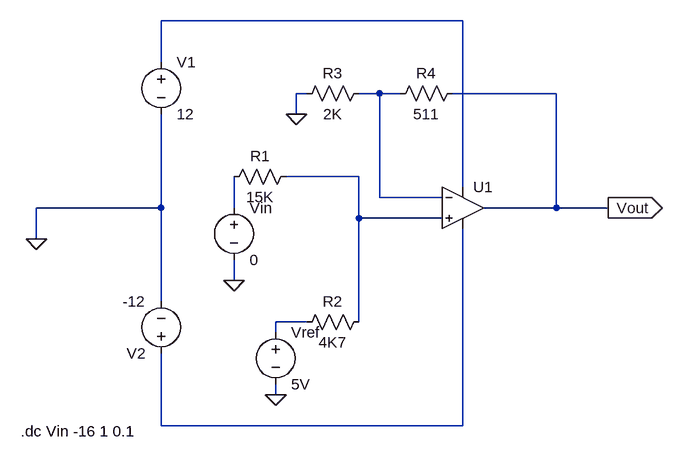
[diagram p0: schematic v-measure-opamp4.asc]
v-measure-opamp4.asc, the LTspice schematic file:
Version 4
SHEET 1 984 680
WIRE 496 32 32 32
WIRE 32 96 32 32
WIRE 256 144 240 144
WIRE 368 144 336 144
WIRE 400 144 368 144
WIRE 640 144 480 144
WIRE 240 176 240 144
WIRE 336 272 224 272
WIRE 496 288 496 32
WIRE 368 304 368 144
WIRE 464 304 368 304
WIRE 32 320 32 176
WIRE 32 320 -160 320
WIRE 144 320 144 272
WIRE 640 320 640 144
WIRE 640 320 528 320
WIRE 720 320 640 320
WIRE 336 336 336 272
WIRE 464 336 336 336
WIRE -160 368 -160 320
WIRE 144 432 144 400
WIRE 32 464 32 320
WIRE 256 496 208 496
WIRE 336 496 336 336
WIRE 208 512 208 496
WIRE 208 608 208 592
WIRE 32 656 32 544
WIRE 496 656 496 352
WIRE 496 656 32 656
FLAG -160 368 0
FLAG 144 432 0
FLAG 208 608 0
FLAG 240 176 0
FLAG 720 320 Vout
IOPIN 720 320 Out
SYMBOL voltage 32 80 R0
WINDOW 123 0 0 Left 2
WINDOW 39 0 0 Left 2
SYMATTR InstName V1
SYMATTR Value 12
SYMBOL voltage 32 560 R180
WINDOW 123 0 0 Left 2
WINDOW 39 0 0 Left 2
SYMATTR InstName V2
SYMATTR Value -12
SYMBOL voltage 144 304 R0
WINDOW 123 0 0 Left 2
WINDOW 39 0 0 Left 2
SYMATTR InstName Vin
SYMATTR Value 0
SYMBOL Opamps\\UniversalOpamp2 496 320 R0
SYMATTR InstName U1
SYMBOL res 240 256 R90
WINDOW 0 0 56 VBottom 2
WINDOW 3 32 56 VTop 2
SYMATTR InstName R1
SYMATTR Value 15K
SYMBOL res 352 480 R90
WINDOW 0 0 56 VBottom 2
WINDOW 3 32 56 VTop 2
SYMATTR InstName R2
SYMATTR Value 4K7
SYMBOL voltage 208 496 R0
SYMATTR InstName Vref
SYMATTR Value 5V
SYMBOL res 352 128 R90
WINDOW 0 0 56 VBottom 2
WINDOW 3 32 56 VTop 2
SYMATTR InstName R3
SYMATTR Value 2K
SYMBOL res 496 128 R90
WINDOW 0 0 56 VBottom 2
WINDOW 3 32 56 VTop 2
SYMATTR InstName R4
SYMATTR Value 511
TEXT -184 664 Left 2 !.dc Vin -16 1 0.1

The netlist it stands for:
* v-measure-opamp4.asc
V1 N001 0 12
V2 N006 0 -12
Vin N004 0 0
XU1 N003 N002 N001 N006 Vout level.2 Avol=1Meg GBW=10Meg Slew=10Meg ilimit=25m rail=0 Vos=0 phimargin=45 en=0 enk=0 in=0 ink=0 Rin=500Meg  ; pins IN+ IN- V+ V- OUT
R1 N003 N004 15K
R2 N003 N005 4K7
Vref N005 0 5V
R3 N002 0 2K
R4 Vout N002 511
.dc Vin -16 1 0.1
.lib UniversalOpamps2.sub
.backanno
.end